# EAGLE schematic main_board (EAGLE 7.5.0)
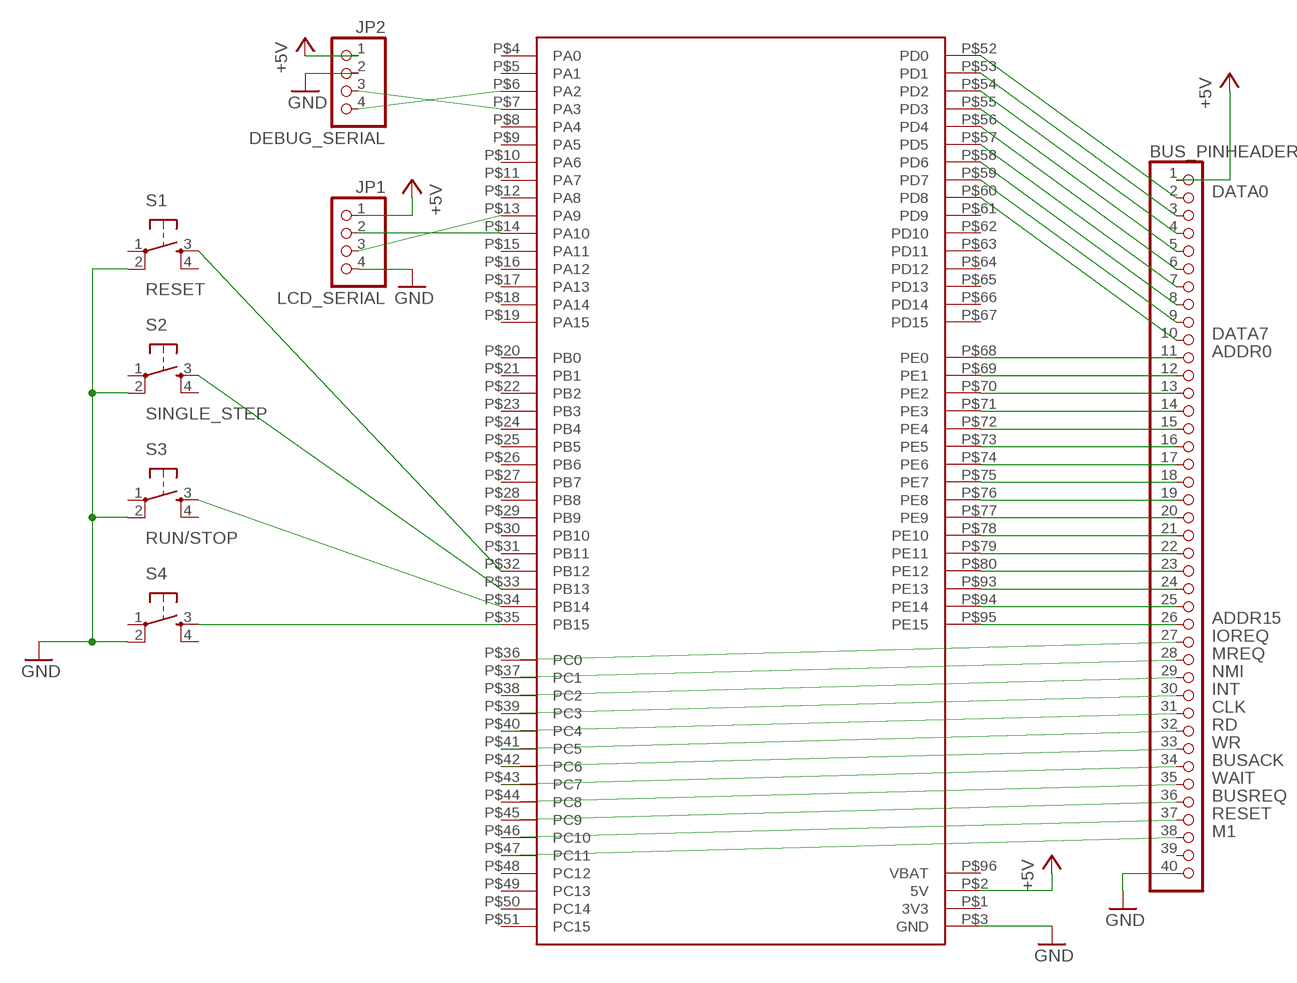
[diagram p0: schematic, sheet 1]

## Parts
BUS_PINHEADER  PINHD-1X40  [1X40]
JP1  LCD_SERIAL  PINHD-1X4  [1X04]
JP2  DEBUG_SERIAL  PINHD-1X4  [1X04]
S1  RESET  TAC_SWITCHPTH  [TACTILE-PTH]
S2  SINGLE_STEP  TAC_SWITCHPTH  [TACTILE-PTH]
S3  RUN/STOP  TAC_SWITCHPTH  [TACTILE-PTH]
S4  TAC_SWITCHPTH  [TACTILE-PTH]
U$1  STM32F103VCT6_BOARD_DEVICE  [STM32F103VCT6_PACK]

## Nets
+5V: BUS_PINHEADER.1 JP1.1 JP2.1 U$1.P$2(5V)
ADDR0: BUS_PINHEADER.11 U$1.P$68(PE0)
ADDR15: BUS_PINHEADER.26 U$1.P$95(PE15)
BUSACK: BUS_PINHEADER.34 U$1.P$43(PC7)
BUSREQ: BUS_PINHEADER.36 U$1.P$45(PC9)
CLK: BUS_PINHEADER.31 U$1.P$40(PC4)
DATA0: BUS_PINHEADER.2 U$1.P$52(PD0)
DATA7: BUS_PINHEADER.10 U$1.P$60(PD8)
GND: BUS_PINHEADER.40 JP1.4 JP2.2 S1.2 S2.2 S3.2 S4.2 U$1.P$3(GND)
INT: BUS_PINHEADER.30 U$1.P$39(PC3)
IOREQ: BUS_PINHEADER.27 U$1.P$36(PC0)
M1: BUS_PINHEADER.38 U$1.P$47(PC11)
MREQ: BUS_PINHEADER.28 U$1.P$37(PC1)
N$2: BUS_PINHEADER.3 U$1.P$53(PD1)
N$3: BUS_PINHEADER.4 U$1.P$54(PD2)
N$4: BUS_PINHEADER.5 U$1.P$55(PD3)
N$5: BUS_PINHEADER.6 U$1.P$56(PD4)
N$6: BUS_PINHEADER.7 U$1.P$57(PD5)
N$7: BUS_PINHEADER.8 U$1.P$58(PD6)
N$8: BUS_PINHEADER.9 U$1.P$59(PD7)
N$9: S1.3 U$1.P$32(PB12)
N$10: S2.3 U$1.P$33(PB13)
N$11: BUS_PINHEADER.12 U$1.P$69(PE1)
N$12: BUS_PINHEADER.13 U$1.P$70(PE2)
N$13: BUS_PINHEADER.14 U$1.P$71(PE3)
N$14: BUS_PINHEADER.15 U$1.P$72(PE4)
N$15: BUS_PINHEADER.16 U$1.P$73(PE5)
N$16: BUS_PINHEADER.17 U$1.P$74(PE6)
N$17: BUS_PINHEADER.18 U$1.P$75(PE7)
N$18: BUS_PINHEADER.19 U$1.P$76(PE8)
N$19: BUS_PINHEADER.20 U$1.P$77(PE9)
N$20: BUS_PINHEADER.21 U$1.P$78(PE10)
N$21: BUS_PINHEADER.22 U$1.P$79(PE11)
N$22: BUS_PINHEADER.23 U$1.P$80(PE12)
N$23: BUS_PINHEADER.24 U$1.P$93(PE13)
N$24: BUS_PINHEADER.25 U$1.P$94(PE14)
N$25: S3.3 U$1.P$34(PB14)
N$26: S4.3 U$1.P$35(PB15)
N$27: JP1.2 U$1.P$14(PA10)
N$28: JP1.3 U$1.P$13(PA9)
N$29: JP2.3 U$1.P$7(PA3)
N$30: JP2.4 U$1.P$6(PA2)
NMI: BUS_PINHEADER.29 U$1.P$38(PC2)
RD: BUS_PINHEADER.32 U$1.P$41(PC5)
RESET: BUS_PINHEADER.37 U$1.P$46(PC10)
WAIT: BUS_PINHEADER.35 U$1.P$44(PC8)
WR: BUS_PINHEADER.33 U$1.P$42(PC6)
Unconnected: BUS_PINHEADER.39 S1.1 S1.4 S2.1 S2.4 S3.1 S3.4 S4.1 S4.4 U$1.P$1(3V3) U$1.P$4(PA0) U$1.P$5(PA1) U$1.P$8(PA4) U$1.P$9(PA5) U$1.P$10(PA6) U$1.P$11(PA7) U$1.P$12(PA8) U$1.P$15(PA11) U$1.P$16(PA12) U$1.P$17(PA13) U$1.P$18(PA14) U$1.P$19(PA15) U$1.P$20(PB0) U$1.P$21(PB1) U$1.P$22(PB2) U$1.P$23(PB3) U$1.P$24(PB4) U$1.P$25(PB5) U$1.P$26(PB6) U$1.P$27(PB7) U$1.P$28(PB8) U$1.P$29(PB9) U$1.P$30(PB10) U$1.P$31(PB11) U$1.P$48(PC12) U$1.P$49(PC13) U$1.P$50(PC14) U$1.P$51(PC15) U$1.P$61(PD9) U$1.P$62(PD10) U$1.P$63(PD11) U$1.P$64(PD12) U$1.P$65(PD13) U$1.P$66(PD14) U$1.P$67(PD15) U$1.P$96(VBAT)

## Library data of the parts
BUS_PINHEADER = pinhead:PINHD-1X40: PIN HEADER
JP1 JP2 = pinhead:PINHD-1X4: PIN HEADER
S1-S4 = SparkFun-Retired:TAC_SWITCH: Momentary Switch Button commonly used for reset or general input. Spark Fun Electronics SKU : COM-00097 SMT- SWCH-08247
U$1 = vct6_board:STM32F103VCT6_BOARD_DEVICE